# Altium schematic sheet PWR_MUX.SchDoc
size A4; SheetNumber: 6; SheetTotal: 9
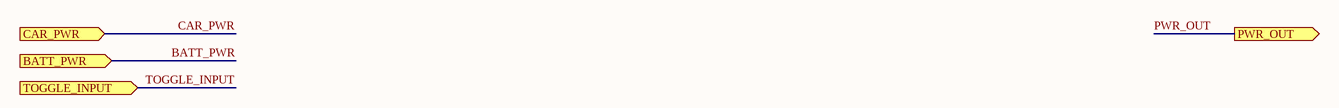
[diagram p0: PWR_MUX.SchDoc]

## Ports
BATT_PWR (in), CAR_PWR (in), PWR_OUT (out), TOGGLE_INPUT (in)

## Nets
BATT_PWR: port BATT_PWR
CAR_PWR: port CAR_PWR
PWR_OUT: port PWR_OUT
TOGGLE_INPUT: port TOGGLE_INPUT